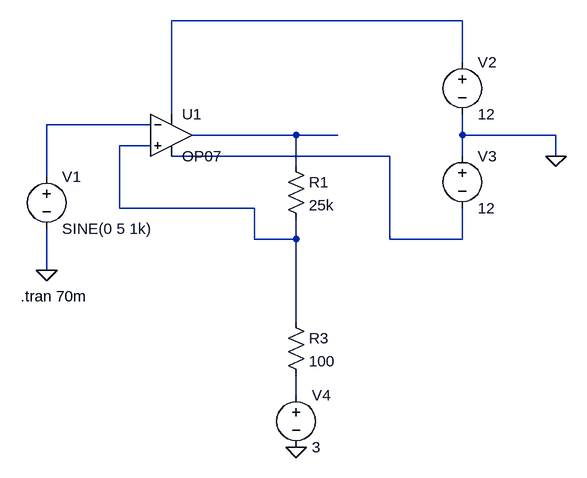
[diagram p0: schematic Schmitt trigger.asc]
Schmitt trigger.asc, the LTspice schematic file:
Version 4.1
SHEET 1 932 680
WIRE 768 -112 320 -112
WIRE 768 -48 768 -112
WIRE 320 32 320 -112
WIRE 288 48 128 48
WIRE 512 64 352 64
WIRE 576 64 512 64
WIRE 768 64 768 32
WIRE 912 64 768 64
WIRE 288 80 240 80
WIRE 656 96 320 96
WIRE 768 96 768 64
WIRE 912 96 912 64
WIRE 512 112 512 64
WIRE 128 128 128 48
WIRE 240 176 240 80
WIRE 448 176 240 176
WIRE 448 224 448 176
WIRE 512 224 512 192
WIRE 512 224 448 224
WIRE 656 224 656 96
WIRE 768 224 768 176
WIRE 768 224 656 224
WIRE 128 272 128 208
WIRE 512 352 512 224
WIRE 512 464 512 432
FLAG 128 272 0
FLAG 912 96 0
FLAG 512 544 0
SYMBOL voltage 128 112 R0
WINDOW 123 0 0 Left 0
WINDOW 39 0 0 Left 0
SYMATTR InstName V1
SYMATTR Value SINE(0 5 1k)
SYMBOL OpAmps\\OP07 320 0 R0
SYMATTR InstName U1
SYMBOL res 496 96 R0
SYMATTR InstName R1
SYMATTR Value 25k
SYMBOL res 496 336 R0
SYMATTR InstName R3
SYMATTR Value 100
SYMBOL voltage 768 -64 R0
WINDOW 123 0 0 Left 0
WINDOW 39 0 0 Left 0
SYMATTR InstName V2
SYMATTR Value 12
SYMBOL voltage 768 80 R0
WINDOW 123 0 0 Left 0
WINDOW 39 0 0 Left 0
SYMATTR InstName V3
SYMATTR Value 12
SYMBOL voltage 512 448 R0
WINDOW 123 0 0 Left 0
WINDOW 39 0 0 Left 0
SYMATTR InstName V4
SYMATTR Value 3
TEXT 88 312 Left 2 !.tran 70m

The netlist it stands for:
* Schmitt trigger.asc
V1 N002 0 SINE(0 5 1k)
X§U1 N004 N002 N001 N005 N003 LT1001  ; OP07, pins In+ In- V+ V- OUT
R1 N003 N004 25k
R3 N004 N006 100
V2 N001 0 12
V3 0 N005 12
V4 N006 0 3
.tran 70m
.lib LTC.lib
.backanno
.end